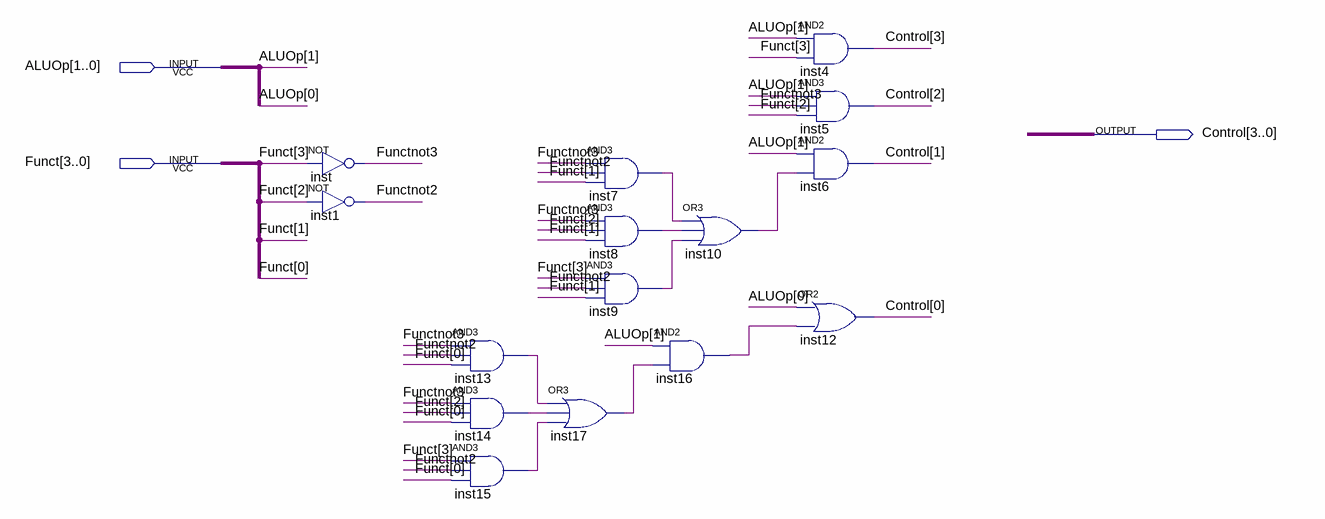
[diagram p0: schematic sheet]
// Quartus schematic alu_control.bdf as structural Verilog: 15 symbols, 3 pins
module alu_control (
  input  [1:0] ALUOp,
  input  [3:0] Funct,
  output [3:0] Control
);

  wire Functnot2, Functnot3, inst7_out, inst8_out, inst9_out, inst10_out, inst13_out, inst14_out, inst15_out,
       inst16_out, inst17_out;

  not inst (Functnot3, Funct[3]);
  not inst1 (Functnot2, Funct[2]);
  and inst13 (inst13_out, Functnot3, Functnot2, Funct[0]);
  and inst14 (inst14_out, Functnot3, Funct[2], Funct[0]);
  and inst15 (inst15_out, Funct[3], Functnot2, Funct[0]);
  and inst7 (inst7_out, Functnot3, Functnot2, Funct[1]);
  and inst8 (inst8_out, Functnot3, Funct[2], Funct[1]);
  and inst9 (inst9_out, Funct[3], Functnot2, Funct[1]);
  or inst17 (inst17_out, inst13_out, inst14_out, inst15_out);
  and inst16 (inst16_out, ALUOp[1], inst17_out);
  or inst10 (inst10_out, inst7_out, inst8_out, inst9_out);
  and inst4 (Control[3], ALUOp[1], Funct[3]);
  and inst5 (Control[2], ALUOp[1], Functnot3, Funct[2]);
  and inst6 (Control[1], ALUOp[1], inst10_out);
  or inst12 (Control[0], ALUOp[0], inst16_out);
endmodule
